# Altium project Node Controller v2.PrjPcb
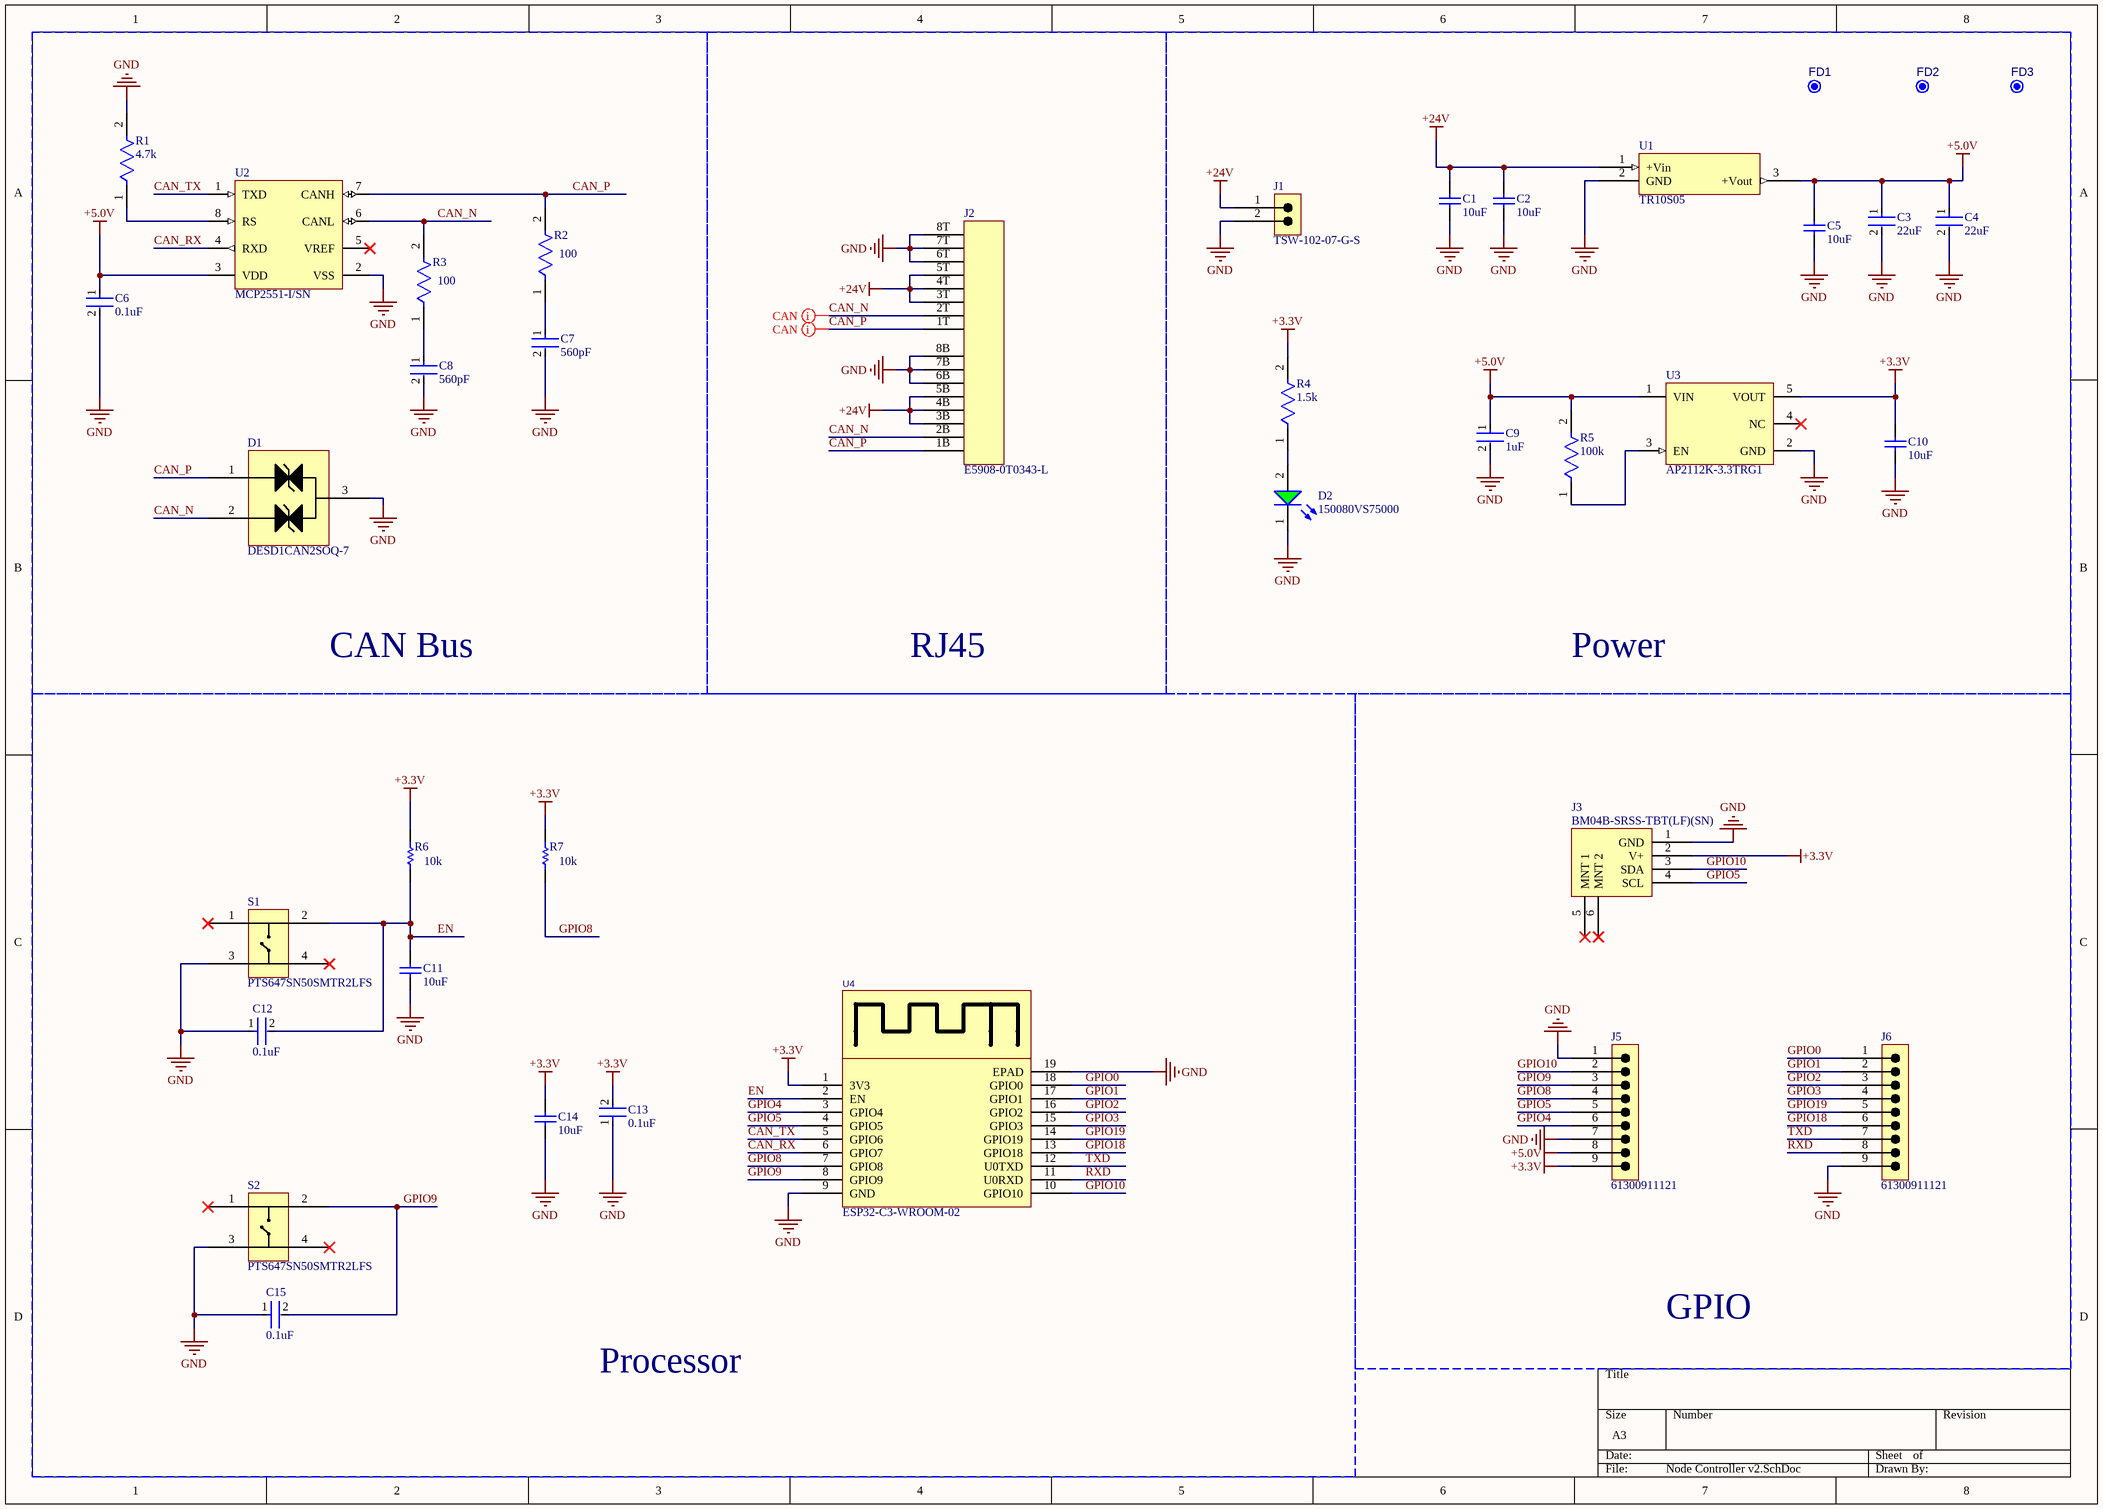
[diagram p0: Node Controller v2.SchDoc]
1 sheet, 38 parts. Net scope: global (net labels, ports and power ports of the same name join across sheets).
Board files: Node Controller v2.PcbDoc, Node Controller v2 - old.PcbDoc

## Sheet Node Controller v2.SchDoc
size A3

### Parts
C1  10uF  [CAPC2013X145X50ML20T25]
C2  10uF  [CAPC2013X145X50ML20T25]
C3  22uF  [FP-GMC21R-IPC_B]
C4  22uF  [FP-GMC21R-IPC_B]
C5  10uF  [CAPC2013X145X50ML20T25]
C6  0.1uF  [FP-CC0603-DA-IPC_A]
C7  560pF  [FP-CC0805-0_85-IPC_A]
C8  560pF  [FP-CC0805-0_85-IPC_A]
C9  1uF  [FP-CL21-IPC_A]
C10  10uF  [CAPC2013X145X50ML20T25]
C11  10uF  [CAPC2013X145X50ML20T25]
C12  0.1uF  [FP-CC0603-DA-IPC_A]
C13  0.1uF  [FP-CC0603-DA-IPC_A]
C14  10uF  [CAPC2013X145X50ML20T25]
C15  0.1uF  [FP-CC0603-DA-IPC_A]
D1  DESD1CAN2SOQ-7  [SOT95P245X110-3N]
D2  150080VS75000  [WL-SMCW_0805_150080xx75000]
FD1  JLC FID1X2R  [FID1X2R]  (value not drawn)  (no BOM)
FD2  JLC FID1X2R  [FID1X2R]  (value not drawn)  (no BOM)
FD3  JLC FID1X2R  [FID1X2R]  (value not drawn)  (no BOM)
J1  TSW-102-07-G-S  [FP-TSW-102-07-G-S-MFG]
J2  E5908-0T0343-L  [E5908-0T0343-L-Footprint-1]
J3  BM04B-SRSS-TBT(LF)(SN)  [FP-BM04B-SRSS-TBT_LF_SN-MFG]
J5  61300911121  [61300911121]
J6  61300911121  [61300911121]
R1  4.7k  [FP-RT0805-IPC_A]
R2  100  [FP-RT0805-0_6-IPC_A]
R3  100  [FP-RT0805-0_6-IPC_A]
R4  1.5k  [FP-RT0805-IPC_A]
R5  100k  [FP-RT0805-IPC_A]
R6  10k  [RESC2013X60X35ML10T20]
R7  10k  [RESC2013X60X35ML10T20]
S1  PTS647SN50SMTR2LFS  [PTS647SN50SMTR2LFS-Footprint-1]
S2  PTS647SN50SMTR2LFS  [PTS647SN50SMTR2LFS-Footprint-1]
U1  TR10S05  [TR10S05-Footprint-1]
U2  MCP2551-I/SN  [MCHP-SN8_V]
U3  AP2112K-3.3TRG1  [FP-SOT25-IPC_B]
U4  ESP32-C3-WROOM-02  [ESP32-C3-WROOM-02]

### Blocks framed on the sheet
CAN Bus: C6-C8 D1 R1-R3 U2
RJ45: J2
Power: C1-C5 C9 C10 D2 FD1-FD3 J1 R4 R5 U1 U3
Processor: C11-C15 R6 R7 S1 S2 U4
GPIO: J3 J5 J6

### Nets
+3.3V: C10.2 C13.2 C14.2 J3.2(V+) J5.9 R4.2 R6.2 R7.2 U3.5(VOUT) U4.1(3V3)
+5.0V: C3.1 C4.1 C5.2 C6.1 C9.1 J5.8 R5.2 U1.3(+Vout) U2.3(VDD) U3.1(VIN)
+24V: C1.2 C2.2 J1.1 J2.3B J2.3T J2.4B J2.4T J2.5B J2.5T U1.1(+Vin)
GND: C1.1 C2.1 C3.2 C4.2 C5.1 C6.2 C7.2 C8.2 C9.2 C10.1 C11.1 C12.1 C13.1 C14.1 C15.1 D1.3 D2.1(K) J1.2 J2.6B J2.6T J2.7B J2.7T J2.8B J2.8T J3.1(GND) J5.1 J5.7 J6.9 R1.2 S1.3 S2.3 U1.2(GND) U2.2(VSS) U3.2(GND) U4.9(GND) U4.19(EPAD)
CAN_N: D1.2 J2.2B J2.2T R3.2 U2.6(CANL)
CAN_P: D1.1 J2.1B J2.1T R2.2 U2.7(CANH)
CAN_RX: U2.4(RXD) U4.6(GPIO7)
CAN_TX: U2.1(TXD) U4.5(GPIO6)
EN: C11.2 C12.2 R6.1 S1.2 U4.2(EN)
GPIO0: J6.1 U4.18(GPIO0)
GPIO1: J6.2 U4.17(GPIO1)
GPIO2: J6.3 U4.16(GPIO2)
GPIO3: J6.4 U4.15(GPIO3)
GPIO4: J5.6 U4.3(GPIO4)
GPIO5: J3.4(SCL) J5.5 U4.4(GPIO5)
GPIO8: J5.4 R7.1 U4.7(GPIO8)
GPIO9: C15.2 J5.3 S2.2 U4.8(GPIO9)
GPIO10: J3.3(SDA) J5.2 U4.10(GPIO10)
GPIO18: J6.6 U4.13(GPIO18)
GPIO19: J6.5 U4.14(GPIO19)
RXD: J6.8 U4.11(U0RXD)
TXD: J6.7 U4.12(U0TXD)
NetC7_1: C7.1 R2.1
NetC8_1: C8.1 R3.1
NetD2_2: D2.2(A) R4.1
NetR1_1: R1.1 U2.8(RS)
NetR5_1: R5.1 U3.3(EN)

Not connected (* = marked no-connect by the designer): J3 5(MNT_1)* 6(MNT_2)*; S1 1* 4*; S2 1* 4*; U2 5(VREF)*; U3 4(NC)*

### Layout directives
differential pair: CAN_N, CAN_P

### Library data of the parts
C1 C2 C5 C10 C11 C14 = CMP-00010-1: Ceramic Capacitor, Multilayer, Ceramic, 10V, 80% +Tol, 20% -Tol, Y5V, -82/+22% TC, 10uF, Surface Mount, 0805; Multilayer: Yes; Min Operating Temperature: -30°C; Case/Package: 0805; Package Shape: Rectangular; RoHS Compliant: Yes; Termination: Wraparound; Package Style: SMTMeter; Packaging: Tape and Reel; Temperature Characteristics Code: Y5V; Pins: 2; Capacitor Type: Ceramic; Terminal Finish: Nickel; Tolerance (fill in as +-): 80%; Value: 10uF; Max Operating Temperature: 85°C; Length: 2mm; Width: 1.25mm; Dielectric Material: Ceramic; JESD-609 Code: e3; Reach SVHC Compliant: Yes; Height: 1.25mm; Tolerance  (fill in as +-): 20%; Mounting Technology: Surface Mount; Rated DC Voltage (URdc): 10V
C3 C4 = CMP-00027-1: Ceramic Capacitor, Multilayer, Ceramic, 35V, 20% +Tol, 20% -Tol, X5R, 15% TC, 22uF, Surface Mount, 0805
C6 C12 C13 C15 = CMP-00002-1: Ceramic Capacitor, Multilayer, Ceramic, 50V, 10% +Tol, 10% -Tol, X7R, 15% TC, 0.1uF, Surface Mount, 0603; Value: 100nF; Multilayer: Yes; Reach SVHC Compliant: Yes; Temperature Characteristics Code: X7R; Package Style: SMTMeter; Max Operating Temperature: 125°C; Dielectric Material: Ceramic; Mounting Technology: Surface Mount; Packaging: Tape and Reel; Width: 0.8mm; Min Operating Temperature: -55°C; Height: 0.8mm; RoHS Compliant: Yes; Rated DC Voltage (URdc): 50V; Tolerance (fill in as +-): 10%; Terminal Finish: Nickel; Case/Package: 0603; Length: 1.6mm; Tolerance  (fill in as +-): 10%; JESD-609 Code: e3; Package Shape: Rectangular; Capacitor Type: Ceramic; Pins: 2; Termination: Wraparound
C7 C8 = CMP-00033-1: Ceramic Capacitor, Multilayer, Ceramic, 50V, 10% +Tol, 10% -Tol, X7R, 15% TC, 0.00056uF, Surface Mount, 0805; Multilayer: Yes; Reach SVHC Compliant: Yes; RoHS Compliant: Yes; Value: 560pF; Tolerance (fill in as +-): 10%; Tolerance  (fill in as +-): 10%; Packaging: Tape and Reel; Termination: Wraparound; Mounting Technology: Surface Mount; Rated DC Voltage (URdc): 50V; Temperature Characteristics Code: X7R; Terminal Finish: Nickel; Package Shape: Rectangular; Min Operating Temperature: -55°C; Max Operating Temperature: 125°C; Capacitor Type: Ceramic; Pins: 2; Case/Package: 0805; JESD-609 Code: e3; Dielectric Material: Ceramic
C9 = CMP-00019-1: Ceramic Capacitor, Multilayer, Ceramic, 50V, 10% +Tol, 10% -Tol, X7R, 15% TC, 1uF, Surface Mount, 0805; Multilayer: Yes; Value: 1µF; Dielectric Material: Ceramic; Packaging: Tape and Reel; Height: 1.35mm; JESD-609 Code: e3; Max Operating Temperature: 125°C; Capacitor Type: Ceramic; Terminal Finish: Nickel; Min Operating Temperature: -55°C; Package Shape: Rectangular; RoHS Compliant: Yes; Termination: Wraparound; Width: 1.25mm; Tolerance  (fill in as +-): 10%; Package Style: SMTMeter; Reach SVHC Compliant: Yes; Tolerance (fill in as +-): 10%; Pins: 2; Length: 2mm; Mounting Technology: Surface Mount; Rated DC Voltage (URdc): 50V; Case/Package: 0805; Temperature Characteristics Code: X7R
D1 = CMP-00024-2: Trans Voltage Suppressor Diode, 200W, 24V V(RWM), Bidirectional, 2 Element, Silicon; Time @ Peak Reflow Temperature-Max (s): 30s; Reference Standard: AEC-Q101; Max Power Dissipation: 300mW; Min Breakdown Voltage: 25.4V; Number of Elements: 2; Additional Feature: HIGH RELIABILITY; Max Breakdown Voltage: 30.3V; Package Body Material: Plastic; Technology: AVALANCHE; JESD-30 Code: R-PDSO-G3; Reach SVHC Compliant: Yes; RoHS Compliant: Yes; Min Operating Temperature: -65°C; JESD-609 Code: e3; Surface Mount: Yes; Max Operating Temperature: 150°C; Pins: 3; Terminal Position: DUAL; Package Shape: Rectangular; Polarity: Bidirectional; Non-rep Peak Rev Power Dis-Max: 200W; Moisture Sensitivity Level: 1; Terminal Finish: Tin; Package Style: SMALL OUTLINEMeter; Peak Reflow Temperature (Cel): 260°C; Rep Pk Reverse Voltage-Max: 24V; Terminal Form: Gull Wing; Diode Type: TRANS VOLTAGE SUPPRESSOR; Diode Element Material: SILICON
D2 = CMP-00021-1: Single Color LED, Bright Green, Water Clear, 1.4mm; Shape: Rectangular; Luminous Intensity-Nom: 40mcd; Viewing Angle: 140°; Channels: 1; Forward Current: 30mA; Overall Height: 0.7mm; RoHS Compliant: Yes; Max Operating Temperature: 85°C; Optoelectronic Device Type: SINGLE COLOR LED; Color: Green; Min Operating Temperature: -40°C; Terminal Pitch: 2.1mm; Mounting Technology: Surface Mount; Packaging: Tape and Reel; Reach SVHC Compliant: Yes; Size: 1.4mm; Lens Style: WATER CLEAR; Pins: 2
FD1-FD3 = CMP-00028-00011-4: Fiducial - Round 1x2mm; Pins: 0
J1 = CMP-00020-2: Board Connector, 2 Contact(s), 1 Row(s), Male, Straight, 0.1 inch Pitch, Solder Terminal, Black Insulator; Additional Feature: E.L.P.; Mixed Contacts: No; Plating Thickness: 10uin; Reliability: COMMERCIAL; Number of Rows Loaded: 1; Option: General Purpose; Number of Contacts: 2; Body/Shell Style: RECEPTACLE; PCB Contact Pattern: RECTANGULAR; Contact Style: SQ PIN-SKT; Mating Information: MULTIPLE MATING PARTS AVAILABLE; Reference Standard: UL; Mating Contact Pitch: 0.1inch; DIN Conformance: No; Terminal Length: 0.1inch; Flammability Rating: UL94 V-0; Body Depth: 0.1inch; Contact Finish - Termination: Gold (Au) - with Nickel (Ni) barrier; Body Breadth: 0.1inch; Reach SVHC Compliant: Yes; MIL Conformance: No; Contact Pattern: RECTANGULAR; Termination: Solder; Insulation Material: Glass; Insulation Color: Black; Terminal Pitch: 2.54mm; Filter Feature: No; Connector Type: BOARD CONNECTOR; Mounting Style: STRAIGHT; Contact Material: Bronze; Number Of Connectors: 1; Number Of PCB Rows: 1; IEC Conformance: No; Contact Finish - Mating: GOLD (10) OVER NICKEL (50); JESD-609 Code: e4; RoHS Compliant: Yes; Contact Gender: Male; Mounting Technology: Board
J2 = CMP-002-00077-7: Telecom and Datacom Connector, 16 Contact(s), Female, Right Angle, Solder Terminal, Jack; Manufacturer Series: E5908; Mixed Contacts: No; Number of Contacts: 16; Option: General Purpose; RoHS Compliant: Yes; Contact Finish - Mating: GOLD (15) OVER NICKEL; Shell Material: Glass; Body/Shell Style: JACK; Mounting Technology: Board; Contact Gender: Female; Termination: Solder; JESD-609 Code: e4; Filter Feature: No; Mounting Style: RIGHT ANGLE; IEC Conformance: No; Reach SVHC Compliant: Yes; Flammability Rating: UL94 V-0; DIN Conformance: No; Contact Finish - Termination: GOLD (15) OVER NICKEL; Insulation Material: Glass; Empty Shell: No; MIL Conformance: No; Connector Type: TELECOM AND DATACOM CONNECTOR
J3 = CMP-002-00076-4: 1.0mm Pitch, Ultra-Compact, Low Profile Design, Interchangeable Shrouded Header
J5 J6 = CMP-00023-4: Board Connector, 9 Contact(s), 1 Row(s), Male, Straight, 0.1 inch Pitch, Solder Terminal, Locking, Black Insulator, Plug; Reliability: COMMERCIAL; PCB Contact Pattern: RECTANGULAR; Number of Rows Loaded: 1; Contact Resistance: 20mR; Reference Standard: UL; Rated Current (Signal): 3A; Body Length: 0.9inch; Dielectric Withstanding Voltage (AC): 500V; Contact Style: SQ PIN-SKT; Insulation Resistance: 1GR; Number of Contacts: 9; Contact Finish - Termination: Gold (Au) - with Nickel (Ni) barrier; Contact Material: Copper Alloy; Mating Contact Pitch: 0.1inch; Insulation Material: Polybutylene; Mounting Technology: Board; Mounting Option 1: LOCKING; Max Operating Temperature: 125°C; Body/Shell Style: PLUG; Min Operating Temperature: -40°C; Contact Gender: Male; Connector Type: BOARD CONNECTOR; RoHS Compliant: Yes; Mounting Style: STRAIGHT; Terminal Pitch: 2.54mm; Contact Pattern: RECTANGULAR; Termination: Solder; Terminal Length: 0.118inch; Number Of Connectors: 1; Reach SVHC Compliant: Yes; Body Depth: 0.1inch; Body Breadth: 0.1inch; Insulation Color: Black; JESD-609 Code: e4; Contact Finish - Mating: GOLD
R1 = CMP-00015-1: Fixed Resistor, Thin Film, 0.125W, 4700ohm, 150V, 1% +/-Tol, 50ppm/Cel, Surface Mount, 0805; Temperature Coefficient: 50ppm/°C; Package Height: 0.5mm; Rated Temperature: 70°C; Power: 125mW; Additional Feature: HIGH PRECISION; Value: 4.7kR; Package Length: 2mm; Package Width: 1.25mm; Construction: Chip; Resistor Type: FIXED RESISTOR; Pins: 2; Reach SVHC Compliant: Yes; Tolerance: 1%; Package Style: SMTMeter; Packaging: Tape and Reel; RoHS Compliant: Yes; Termination: Wraparound; Mounting Technology: Surface Mount; Case/Package: 0805; Max Operating Temperature: 155°C; Technology: THIN FILM; Min Operating Temperature: -55°C; Working Voltage: 150V
R2 R3 = CMP-00016-1: Fixed Resistor, Thin Film, 0.125W, 100ohm, 150V, 0.1% +/-Tol, 25ppm/Cel, Surface Mount, 0805; Package Height: 0.5mm; Package Length: 2mm; Rated Temperature: 70°C; Temperature Coefficient: 25ppm/°C; Value: 100R; Power: 125mW; Additional Feature: HIGH PRECISION; Package Width: 1.25mm; Packaging: Tape and Reel; Max Operating Temperature: 155°C; Construction: Chip; Pins: 2; Termination: Wraparound; Mounting Technology: Surface Mount; Reach SVHC Compliant: Yes; Case/Package: 0805; Package Style: SMTMeter; RoHS Compliant: Yes; Working Voltage: 150V; Min Operating Temperature: -55°C; Technology: THIN FILM; Resistor Type: FIXED RESISTOR; Tolerance: 0.1%
R4 = CMP-00013-1: Fixed Resistor, Thin Film, 0.125W, 1500ohm, 150V, 1% +/-Tol, 50ppm/Cel, Surface Mount, 0805; Package Width: 1.25mm; Package Height: 0.5mm; Additional Feature: HIGH PRECISION; Temperature Coefficient: 50ppm/°C; Power: 125mW; Rated Temperature: 70°C; Package Length: 2mm; Value: 1.5kR; Termination: Wraparound; Packaging: Tape and Reel; Reach SVHC Compliant: Yes; Pins: 2; Working Voltage: 150V; Construction: Chip; Package Style: SMTMeter; Max Operating Temperature: 155°C; Case/Package: 0805; Resistor Type: FIXED RESISTOR; Mounting Technology: Surface Mount; Technology: THIN FILM; Min Operating Temperature: -55°C; Tolerance: 1%; RoHS Compliant: Yes
R5 = CMP-00014-1: Fixed Resistor, Thin Film, 0.125W, 100000ohm, 150V, 1% +/-Tol, 50ppm/Cel, Surface Mount, 0805; Package Length: 2mm; Rated Temperature: 70°C; Power: 125mW; Package Width: 1.25mm; Additional Feature: HIGH PRECISION; Package Height: 0.5mm; Value: 100kR; Temperature Coefficient: 50ppm/°C; Pins: 2; Case/Package: 0805; Construction: Chip; Max Operating Temperature: 155°C; Mounting Technology: Surface Mount; Tolerance: 1%; Technology: THIN FILM; Package Style: SMTMeter; Reach SVHC Compliant: Yes; Termination: Wraparound; Packaging: Tape and Reel; Resistor Type: FIXED RESISTOR; Working Voltage: 150V; Min Operating Temperature: -55°C; RoHS Compliant: Yes
R6 R7 = CMP-00012-1: Fixed Resistor, Metal Glaze/thick Film, 0.125W, 10000ohm, 150V, 1% +/-Tol, 100ppm/Cel, Surface Mount, 0805; Package Width: 1.25mm; Rated Temperature: 70°C; Package Height: 0.5mm; Power: 125mW; Additional Feature: LASER TRIMMABLE; Temperature Coefficient: 100ppm/°C; Value: 10kR; Package Length: 2mm; Min Operating Temperature: -55°C; Working Voltage: 150V; Case/Package: 0805; Construction: Chip; Termination: Wraparound; Package Shape: Rectangular; Packaging: Tape and Reel; Technology: METAL GLAZE/THICK FILM; RoHS Compliant: Yes; Tolerance: 1%; Reach SVHC Compliant: Yes; Mounting Technology: Surface Mount; Pins: 2; Terminal Finish: Nickel; JESD-609 Code: e3; Max Operating Temperature: 155°C; Package Style: SMTMeter; Resistor Type: FIXED RESISTOR
S1 S2 = CMP-011-00013-3: Keypad Switch, 1 Switches, SPST, Momentary-tactile, 0.05A, 12VDC, 1.47N, Solder Terminal, Surface Mount-straight; RoHS Compliant: Yes
U1 = CMP-019-00050-2: DC-DC Regulated Power Supply Module; Reach SVHC Compliant: Yes; RoHS Compliant: Yes; Throw Configuration: DC-DC REGULATED POWER SUPPLY MODULE
U2 = CMP-015-00008-2: CAN Transceiver, 1-Trnsvr, PDSO8; Max Supply Current: 75uA; Power Supplies: 5V; Number of Transceivers: 1; Data Rate: 1000Mbps; Qualification Status: Not Qualified; Time @ Peak Reflow Temperature-Max (s): 40s; Telecom IC Type: INTERFACE CIRCUIT; Package Equivalence Code: SOP8,.25; Package Body Material: Plastic; Technology: CMOS; Min Operating Temperature: -40°C; RoHS Compliant: Yes; Height - Seated (Max): 1.75mm; Terminal Position: DUAL; Surface Mount: Yes; Package Style: SMALL OUTLINEMeter; Terminal Finish: Tin; Terminal Pitch: 1.27mm; JESD-30 Code: R-PDSO-G8; Case/Package: SOP; Nominal Supply Voltage: 5V; Width: 3.9mm; Length: 4.9mm; Peak Reflow Temperature (Cel): 260°C; Package Shape: Rectangular; Channels: 1; Reach SVHC Compliant: Yes; Pins: 8; Temperature Grade: INDUSTRIAL; Terminal Form: Gull Wing; JESD-609 Code: e3; Max Operating Temperature: 85°C; Moisture Sensitivity Level: 1
U3 = CMP-019-00049-4: Fixed Positive LDO Regulator, 3.3V, 0.4V Dropout, CMOS, PDSO5; Max Supply Voltage: 6V; Case/Package: LSSOP; RoHS Compliant: Yes; Max Operating Temperature: 85°C; Min Operating Temperature: -40°C; Pins: 5
U4 = CMP-005-00015-5: ki_keywords: esp32-c3 module; ki_description: ESP32-C3-WROOM-02 is a general-purpose Wi-Fi and Bluetooth LE module. This module features a rich set of peripherals and high performance, which makes it an ideal choice for smart home, industrial automation, health care, consumer electronics, etc.; Reference: U; Source: NodeController.SCHLIB; Design Item ID: ESP32-C3-WROOM-02; Value: ESP32-C3-WROOM-02; Datasheet: https://www.espressif.com/sites/default/files/documentation/esp32-c3-wroom-02_datasheet_en.pdf